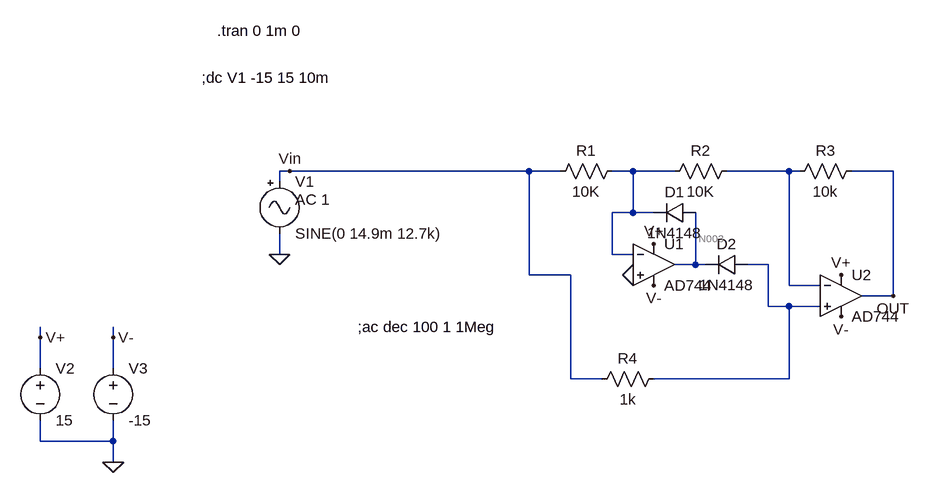
[diagram p0: schematic redresor.asc]
redresor.asc, the LTspice schematic file:
Version 4
SHEET 1 956 680
WIRE -448 -304 -464 -304
WIRE -80 -304 -448 -304
WIRE -32 -304 -80 -304
WIRE 80 -304 48 -304
WIRE 144 -304 80 -304
WIRE 320 -304 224 -304
WIRE 336 -304 320 -304
WIRE 480 -304 416 -304
WIRE -464 -288 -464 -304
WIRE 80 -240 80 -304
WIRE 80 -240 48 -240
WIRE 112 -240 80 -240
WIRE -464 -176 -464 -208
WIRE 48 -176 48 -240
WIRE 80 -176 48 -176
WIRE 176 -160 176 -240
WIRE 176 -160 144 -160
WIRE 192 -160 176 -160
WIRE 288 -160 256 -160
WIRE -80 -144 -80 -304
WIRE -16 -144 -80 -144
WIRE 320 -128 320 -304
WIRE 368 -128 320 -128
WIRE 480 -112 480 -304
WIRE 480 -112 432 -112
WIRE 288 -96 288 -160
WIRE 320 -96 288 -96
WIRE 368 -96 320 -96
WIRE -832 -48 -832 -64
WIRE -720 -48 -720 -64
WIRE -832 0 -832 -48
WIRE -720 0 -720 -48
WIRE -16 16 -16 -144
WIRE 32 16 -16 16
WIRE 320 16 320 -96
WIRE 320 16 112 16
WIRE -832 112 -832 80
WIRE -720 112 -720 80
WIRE -720 112 -832 112
WIRE -720 144 -720 112
FLAG -464 -176 0
FLAG -720 144 0
FLAG -832 -48 V+
FLAG -720 -48 V-
FLAG -448 -304 Vin
FLAG 80 -144 0
FLAG 112 -192 V+
FLAG 400 -144 V+
FLAG 112 -128 V-
FLAG 400 -80 V-
FLAG 480 -112 OUT
SYMBOL voltage -832 -16 R0
WINDOW 123 0 0 Left 2
WINDOW 39 0 0 Left 2
SYMATTR InstName V2
SYMATTR Value 15
SYMBOL voltage -720 -16 R0
WINDOW 123 0 0 Left 2
WINDOW 39 0 0 Left 2
SYMATTR InstName V3
SYMATTR Value -15
SYMBOL res 64 -320 R90
WINDOW 0 0 56 VBottom 2
WINDOW 3 32 56 VTop 2
SYMATTR InstName R1
SYMATTR Value 10K
SYMBOL res 240 -320 R90
WINDOW 0 0 56 VBottom 2
WINDOW 3 32 56 VTop 2
SYMATTR InstName R2
SYMATTR Value 10K
SYMBOL res 432 -320 R90
WINDOW 0 0 56 VBottom 2
WINDOW 3 32 56 VTop 2
SYMATTR InstName R3
SYMATTR Value 10k
SYMBOL OpAmps\\AD744 400 -176 R0
SYMATTR InstName U2
SYMBOL OpAmps\\AD744 112 -224 R0
SYMATTR InstName U1
SYMBOL diode 176 -256 R90
WINDOW 0 0 32 VBottom 2
WINDOW 3 32 32 VTop 2
SYMATTR InstName D1
SYMATTR Value 1N4148
SYMBOL diode 256 -176 R90
WINDOW 0 0 32 VBottom 2
WINDOW 3 32 32 VTop 2
SYMATTR InstName D2
SYMATTR Value 1N4148
SYMBOL res 128 0 R90
WINDOW 0 0 56 VBottom 2
WINDOW 3 32 56 VTop 2
SYMATTR InstName R4
SYMATTR Value 1k
SYMBOL Misc\\signal -464 -304 R0
WINDOW 123 24 44 Left 2
WINDOW 39 0 0 Left 0
SYMATTR Value2 AC 1
SYMATTR InstName V1
SYMATTR Value SINE(0 14.9m 12.7k)
TEXT -560 -520 Left 2 !.tran 0 1m 0
TEXT -584 -448 Left 2 !;dc V1 -15 15 10m
TEXT -344 -64 Left 2 !;ac dec 100 1 1Meg

The netlist it stands for:
* redresor.asc
V2 V+ 0 15
V3 V- 0 -15
R1 N001 Vin 10K
R2 N002 N001 10K
R3 OUT N002 10k
XU2 N004 N002 V+ V- OUT AD744  ; pins In+ In- V+ V- OUT
XU1 0 N001 V+ V- N003 AD744  ; pins In+ In- V+ V- OUT
D1 N003 N001 1N4148
D2 N004 N003 1N4148
R4 N004 Vin 1k
V1 Vin 0 SINE(0 14.9m 12.7k) AC 1
.model D D
.lib standard.dio
.tran 0 1m 0
;dc V1 -15 15 10m
;ac dec 100 1 1Meg
.backanno
.end

* Results of the author's LTspice run, read from the files saved beside the schematic
* Operating Point, zero values left out:
*   V(v+) = 15 V
*   V(v-) = -15 V
*   V(out) = 1.095 µV
*   V(n003) = 1.927 mV
*   I(D2) = -104.9 pA
*   I(D1) = 109.5 pA
*   I(R4) = -5.099 pA
*   I(R3) = 110 pA
*   I(V1) = -5.626 pA
*   I(V3) = 9.797 mA
*   I(V2) = -9.797 mA
*   Ix(u2:1) = 110 pA
*   Ix(u2:2) = 110 pA
*   Ix(u2:3) = 4.899 mA
*   Ix(u2:4) = -4.899 mA
*   Ix(u2:5) = -110 pA
*   Ix(u1:1) = 110 pA
*   Ix(u1:2) = 110 pA
*   Ix(u1:3) = 4.899 mA
*   Ix(u1:4) = -4.899 mA
*   Ix(u1:5) = -214.4 pA
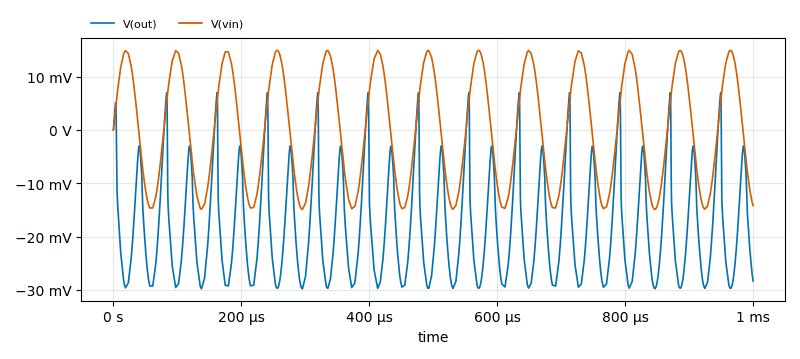
[diagram p1: Transient Analysis of redresor.asc, plotted from the saved traces]
* Transient Analysis, 1 run:
*   V(out): min -29.78 mV, max 6.984 mV, average -18.03 mV, rms 20.79 mV, last -28.3 mV
*   V(vin): min -14.9 mV, max 14.9 mV, average 234.1 µV, rms 10.47 mV, last -14.17 mV